# Altium schematic sheet Ports.SchDoc: External Ports
size A4; Engineer: Jouveer Naidoo; DocumentNumber: 2; Revision: 1; SheetNumber: 3; SheetTotal: 4; ProjectIdentifier: Spin Up
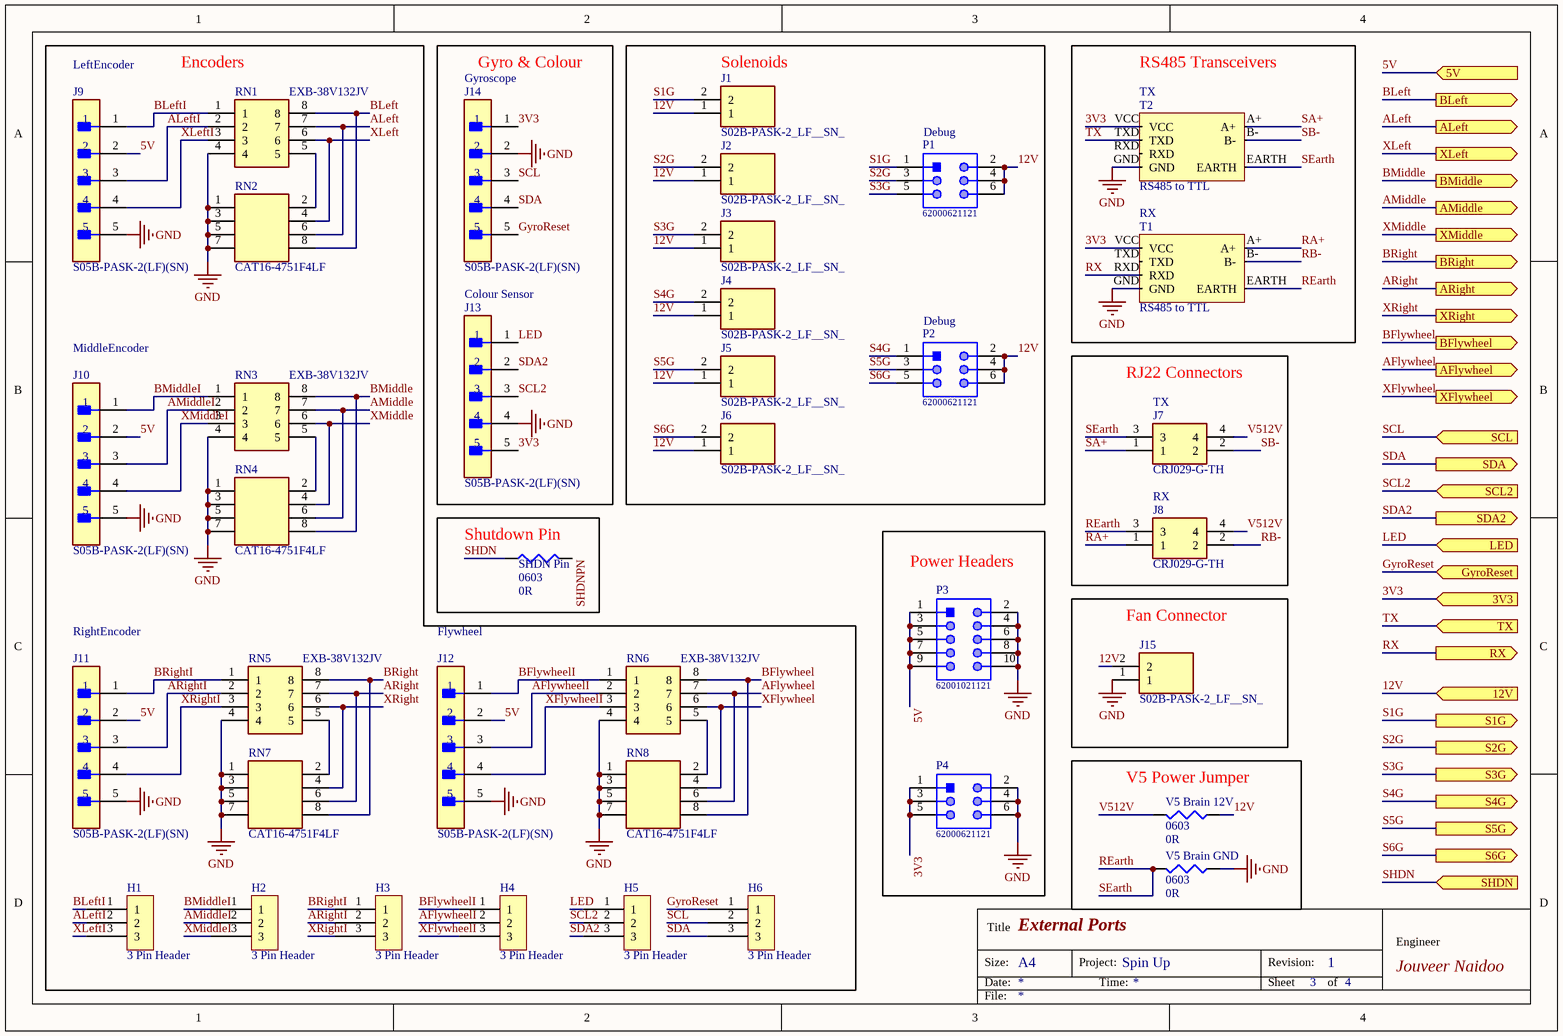
[diagram p0: Ports.SchDoc]

## Parts
H1  3 Pin Header  [3 Pin Header-Footprint-1]
H2  3 Pin Header  [3 Pin Header-Footprint-1]
H3  3 Pin Header  [3 Pin Header-Footprint-1]
H4  3 Pin Header  [3 Pin Header-Footprint-1]
H5  3 Pin Header  [3 Pin Header-Footprint-1]
H6  3 Pin Header  [3 Pin Header-Footprint-1]
J1  S02B-PASK-2_LF__SN_  [S02BPASK2LFSN]
J2  S02B-PASK-2_LF__SN_  [S02BPASK2LFSN]
J3  S02B-PASK-2_LF__SN_  [S02BPASK2LFSN]
J4  S02B-PASK-2_LF__SN_  [S02BPASK2LFSN]
J5  S02B-PASK-2_LF__SN_  [S02BPASK2LFSN]
J6  S02B-PASK-2_LF__SN_  [S02BPASK2LFSN]
J7  CRJ029-G-TH  [CRJ029GTH]
J8  CRJ029-G-TH  [CRJ029GTH]
J9  S05B-PASK-2(LF)(SN)  [FP-S05B-PASK-2_LF_SN-MFG]
J10  S05B-PASK-2(LF)(SN)  [FP-S05B-PASK-2_LF_SN-MFG]
J11  S05B-PASK-2(LF)(SN)  [FP-S05B-PASK-2_LF_SN-MFG]
J12  S05B-PASK-2(LF)(SN)  [FP-S05B-PASK-2_LF_SN-MFG]
J13  S05B-PASK-2(LF)(SN)  [FP-S05B-PASK-2_LF_SN-MFG]
J14  S05B-PASK-2(LF)(SN)  [FP-S05B-PASK-2_LF_SN-MFG]
J15  S02B-PASK-2_LF__SN_  [S02BPASK2LFSN]
P1  62000621121  [62000621121]
P2  62000621121  [62000621121]
P3  62001021121  [62001021121]
P4  62000621121  [62000621121]
RN1  EXB-38V132JV  [EXB38V132JV]
RN2  CAT16-4751F4LF  [CAPCAV80P155X320X60-8L]
RN3  EXB-38V132JV  [EXB38V132JV]
RN4  CAT16-4751F4LF  [CAPCAV80P155X320X60-8L]
RN5  EXB-38V132JV  [EXB38V132JV]
RN6  EXB-38V132JV  [EXB38V132JV]
RN7  CAT16-4751F4LF  [CAPCAV80P155X320X60-8L]
RN8  CAT16-4751F4LF  [CAPCAV80P155X320X60-8L]
SHDN_Pin  0603  value 0R  [J1-0603]
T1  RS485 to TTL  [RS485 to TTL-Footprint-1]
T2  RS485 to TTL  [RS485 to TTL-Footprint-1]
V5_Brain_12V  0603  value 0R  [J1-0603]
V5_Brain_GND  0603  value 0R  [J1-0603]

## Blocks framed on the sheet
Encoders: H1-H6 J9-J12 RN1-RN8
Gyro & Colour: J13 J14
Solenoids: J1-J6 P1 P2
RS485 Transceivers: T1 T2
RJ22 Connectors: J7 J8
Shutdown Pin: SHDN_Pin
Power Headers: P3 P4
Fan Connector: J15
V5 Power Jumper: V5_Brain_12V V5_Brain_GND

## Ports
3V3 (in), 5V (in), 12V (in), AFlywheel (out), ALeft (out), AMiddle (out), ARight (out), BFlywheel (out), BLeft (out), BMiddle (out), BRight (out), GyroReset (in), LED (in), RX (out), S1G (out), S2G (out), S3G (out), S4G (out), S5G (out), S6G (out), SCL2 (in), SCL (in), SDA2 (out), SDA (out), SHDN (in), TX (in), XFlywheel (out), XLeft (out), XMiddle (out), XRight (out)

## Nets
GND: J9.5 J10.5 J11.5 J12.5 J13.4 J14.2 J15.1 P3.2 P3.4 P3.6 P3.8 P3.10 P4.2 P4.4 P4.6 RN1.4 RN2.1 RN2.3 RN2.5 RN2.7 RN3.4 RN4.1 RN4.3 RN4.5 RN4.7 RN5.4 RN6.4 RN7.1 RN7.3 RN7.5 RN7.7 RN8.1 RN8.3 RN8.5 RN8.7 T1.GND T2.GND V5_Brain_GND.1
3V3: J13.5 J14.1 P4.1 P4.3 P4.5 T1.VCC T2.VCC ; port 3V3
5V: J9.2 J10.2 J11.2 J12.2 P3.1 P3.3 P3.5 P3.7 P3.9 ; port 5V
12V: J1.1 J2.1 J3.1 J4.1 J5.1 J6.1 J15.2 P1.2 P1.4 P1.6 P2.2 P2.4 P2.6 V5_Brain_12V.1 ; port 12V
AFlywheel: RN6.7 RN8.6 ; port AFlywheel
AFlywheelI: H4.2 J12.3 RN6.2
ALeft: RN1.7 RN2.6 ; port ALeft
ALeftI: H1.2 J9.3 RN1.2
AMiddle: RN3.7 RN4.6 ; port AMiddle
AMiddleI: H2.2 J10.3 RN3.2
ARight: RN5.7 RN7.6 ; port ARight
ARightI: H3.2 J11.3 RN5.2
BFlywheel: RN6.8 RN8.8 ; port BFlywheel
BFlywheelI: H4.1 J12.1 RN6.1
BLeft: RN1.8 RN2.8 ; port BLeft
BLeftI: H1.1 J9.1 RN1.1
BMiddle: RN3.8 RN4.8 ; port BMiddle
BMiddleI: H2.1 J10.1 RN3.1
BRight: RN5.8 RN7.8 ; port BRight
BRightI: H3.1 J11.1 RN5.1
GyroReset: H6.1 J14.5 ; port GyroReset
LED: H5.1 J13.1 ; port LED
RA+: J8.1 T1.A+
RB-: J8.2 T1.B-
REarth: J7.3 J8.3 T1.EARTH T2.EARTH V5_Brain_GND.2  [also labelled SEarth]
RX: T1.RXD ; port RX
S1G: J1.2 P1.1 ; port S1G
S2G: J2.2 P1.3 ; port S2G
S3G: J3.2 P1.5 ; port S3G
S4G: J4.2 P2.1 ; port S4G
S5G: J5.2 P2.3 ; port S5G
S6G: J6.2 P2.5 ; port S6G
SA+: J7.1 T2.A+
SB-: J7.2 T2.B-
SCL: H6.2 J14.3 ; port SCL
SCL2: H5.2 J13.3 ; port SCL2
SDA: H6.3 J14.4 ; port SDA
SDA2: H5.3 J13.2 ; port SDA2
SHDN: SHDN_Pin.1 ; port SHDN
SHDNPN: SHDN_Pin.2
TX: T2.TXD ; port TX
V512V: J7.4 J8.4 V5_Brain_12V.2
XFlywheel: RN6.6 RN8.4 ; port XFlywheel
XFlywheelI: H4.3 J12.4 RN6.3
XLeft: RN1.6 RN2.4 ; port XLeft
XLeftI: H1.3 J9.4 RN1.3
XMiddle: RN3.6 RN4.4 ; port XMiddle
XMiddleI: H2.3 J10.4 RN3.3
XRight: RN5.6 RN7.4 ; port XRight
XRightI: H3.3 J11.4 RN5.3
NetRN1_5: RN1.5 RN2.2
NetRN3_5: RN3.5 RN4.2
NetRN5_5: RN5.5 RN7.2
NetRN6_5: RN6.5 RN8.2

Not connected (* = marked no-connect by the designer): T1 TXD; T2 RXD

## Notes on the sheet
- LeftEncoder
- (near J14) Gyroscope
- (near T2) TX
- (near P1) Debug
- RX
- Colour Sensor
- MiddleEncoder
- (near P2) Debug
- (near J7) TX
- RightEncoder
- Flywheel
- Size:
- Date:
- Title
- A4
- Project:
- Time:
- Revision:
- Sheet
- of
- Engineer
- File:

## Library data of the parts
H1-H6 = CMP-002-00071-1
J1-J6 J15 = S02B-PASK-2_LF__SN_: Connector; Manufacturer_Name: JST (JAPAN SOLDERLESS TERMINALS); Manufacturer_Part_Number: S02B-PASK-2(LF)(SN); Datasheet Link: http://www.jst-mfg.com/product/pdf/eng/ePA-F.pdf; Height: 6.5mm; Arrow Part Number: S02B-PASK-2(LF)(SN); Arrow Price/Stock: https://www.arrow.com/en/products/s02b-pask-2-lf-sn/jst-manufacturing?region=europe; System: Connector
J7 J8 = CRJ029-G-TH: Connector; Manufacturer_Name: CUI Inc.; Datasheet Link: https://www.cuidevices.com/product/resource/crj029-g-th.pdf; Height: 14.75mm; Manufacturer_Part_Number: CRJ029-G-TH; Mouser Part Number: 490-CRJ029-G-TH; Mouser Price/Stock: https://www.mouser.co.uk/ProductDetail/CUI-Devices/CRJ029-G-TH?qs=iLbezkQI%252Bsg4hjAOAa4IsA%3D%3D; System: Connector
J9-J14 = CMP-17439-000393-1: CONN HEADER R/A 5POS 2MM; Current Rating: 3A; Voltage Rating: 250V; Number of Contacts: 5; System: Connector; Contact Shape: Square; Orientation: Right Angle; Mount: Through Hole; Fastening Type: Ramp; Contact Material: Copper Alloy; Insulation Material: PBT; Insulation Color: Natural; Contact Type: Male Pin; Flammability Rating: UL94 V-0; Contact Plating: Tin; Connector Type: Header; Number of Positions: 5; Contact Finish - Mating: TIN; Housing Color: White; Color: Natural; Termination: Solder; Series: PA; Lead Free: Lead Free; Pitch: 2mm; Number of Rows: 1; Package Quantity: 500; Packaging: Bulk
P1 P2 P4 = CMP-1502-00961-1: THT Vertical Pin Header WR-PHD, Pitch 2.00 mm, Dual Row, 6 pins; Manufacturer: Wurth Elektronik; Gender: Male; Withstanding Voltage: 500VAC; Pin Number: 6; Pitch: 2.00mm; Rated Current: 2A; Contact Resistance: 20mOhm; Working Voltage: 200VAC; Package Reference: 62000621121; Row Number: Dual; Publisher: WurthElektronik; Manufacturer URL: http://www.we-online.de; Part Number: 62000621121; Operating Temperature: -40to105degC; Mounting Technology: THT; Orientation: Vertical; Packaging: Bag; Datasheet URL: https://katalog.we-online.de/em/datasheet/62000621121.pdf
P3 = CMP-1502-00965-1: THT Vertical Pin Header WR-PHD, Pitch 2.00 mm, Dual Row, 10 pins; Manufacturer: Wurth Elektronik; Contact Resistance: 20mOhm; Withstanding Voltage: 500VAC; Gender: Male; Pitch: 2.00mm; Working Voltage: 200VAC; Rated Current: 2A; Pin Number: 10; Row Number: Dual; Orientation: Vertical; Part Number: 62001021121; Manufacturer URL: http://www.we-online.de; Operating Temperature: -40to105degC; Datasheet URL: https://katalog.we-online.de/em/datasheet/62001021121.pdf; Publisher: WurthElektronik; Package Reference: 62001021121; Mounting Technology: THT; Packaging: Bag
RN1 RN3 RN5 RN6 = EXB-38V132JV: Resistor Network; Manufacturer_Name: Panasonic; Datasheet Link: https://industrial.panasonic.com/cdbs/www-data/pdf/AOC0000/AOC0000C14.pdf; Height: 0.6mm; Manufacturer_Part_Number: EXB-38V132JV; Mouser Part Number: 667-EXB-38V132JV; Mouser Price/Stock: https://www.mouser.co.uk/ProductDetail/Panasonic/EXB-38V132JV?qs=WwqriLBepZuuySSdwYXZFg%3D%3D
RN2 RN4 RN7 RN8 = CAT16-4751F4LF: Resistor Network; Manufacturer_Name: Bourns; Datasheet Link: http://www.bourns.com/docs/Product-Datasheets/cat16-j.pdf; Height: 0.6mm; Manufacturer_Part_Number: CAT16-4751F4LF; Mouser Part Number: 652-CAT16-4751F4LF; Mouser Price/Stock: https://www.mouser.co.uk/ProductDetail/Bourns/CAT16-4751F4LF?qs=vP03yYafZdFfyS1KGGbPOQ%3D%3D
SHDN_Pin V5_Brain_12V V5_Brain_GND = Res3: Resistor; Published: 8-Jun-2000; LatestRevisionDate: 29-May-2009; LatestRevisionNote: IPC-7351 Footprint Added.; PackageReference: J1-0603; Publisher: Altium Limited; PackageDescription: Chip Resistor
T1 T2 = CMP-015-00008-4: RS485 to TTL Converter